# EAGLE design Amplifier Breakout (EAGLE 6.3)
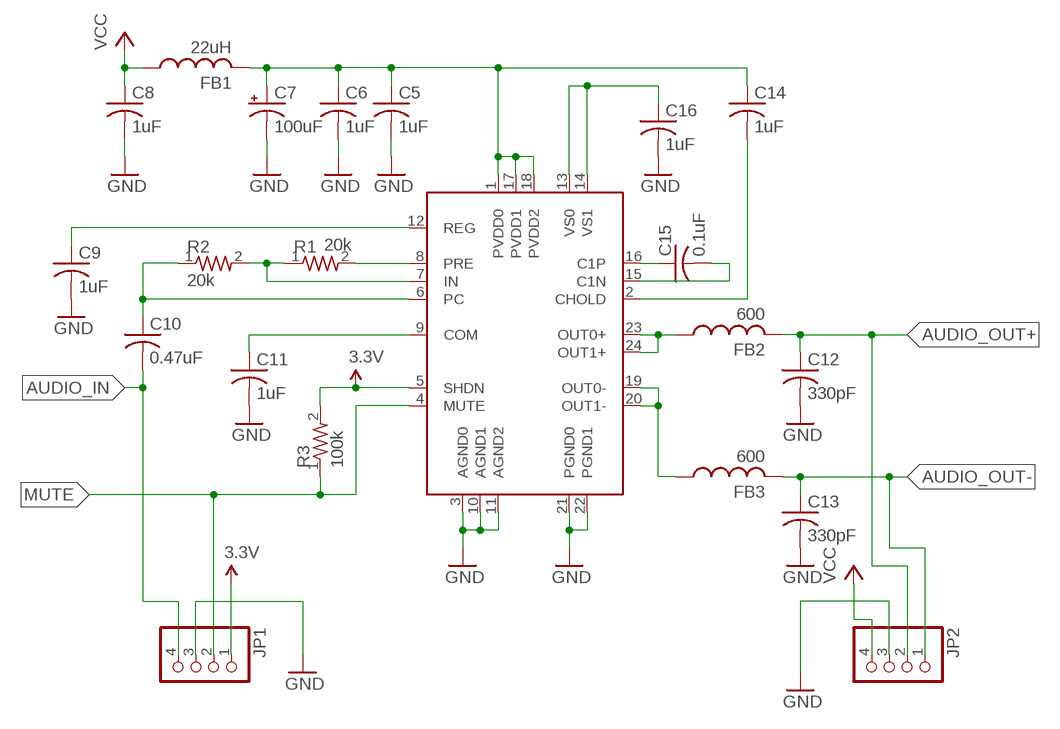
[diagram p0: schematic, sheet 1]

## Parts
C5  1uF  0805_CAP  [FB-0805]
C6  1uF  0805_CAP  [FB-0805]
C7  100uF  CAP_POL_F  [CAP_F]
C8  1uF  0805_CAP  [FB-0805]
C9  1uF  0603_CAP  [0603_RESISTOR]
C10  0.47uF  0603_CAP  [0603_RESISTOR]
C11  1uF  0603_CAP  [0603_RESISTOR]
C12  330pF  0603_CAP  [0603_RESISTOR]
C13  330pF  0603_CAP  [0603_RESISTOR]
C14  1uF  0805_CAP  [FB-0805]
C15  0.1uF  0603_CAP  [0603_RESISTOR]
C16  1uF  0603_CAP  [0603_RESISTOR]
FB1  22uH  FB  [FB-0805]
FB2  600  FB  [FB-0805]
FB3  600  FB  [FB-0805]
JP1  PINHD-1X4  [1X04]
JP2  PINHD-1X4  [1X04]
MAX1  MAX9737  [TQFN24]
R1  20k  0603_RESISTOR  [0603_RESISTOR]
R2  20k  0603_RESISTOR  [0603_RESISTOR]
R3  100k  0603_RESISTOR  [0603_RESISTOR]

## Nets
3.3V: JP1.1 MAX1.5(SHDN) R3.2
AUDIO_IN: C10.2 JP1.4
AUDIO_OUT+: C12.1 FB2.2 JP2.2
AUDIO_OUT-: C13.1 FB3.2 JP2.1
GND: C5.2 C6.2 C7.- C8.2 C9.2 C11.2 C12.2 C13.2 C16.2 JP1.3 JP2.3 MAX1.3(AGND0) MAX1.10(AGND1) MAX1.11(AGND2) MAX1.21(PGND0) MAX1.22(PGND1)
MUTE: JP1.2 MAX1.4(MUTE) R3.1
N$2: C9.1 MAX1.12(REG)
N$3: MAX1.8(PRE) R1.2
N$4: C5.1 C6.1 C7.+ C14.1 FB1.2 MAX1.1(PVDD0) MAX1.17(PVDD1) MAX1.18(PVDD2)
N$5: MAX1.7(IN) R1.1 R2.2
N$6: C10.1 MAX1.6(PC) R2.1
N$7: C11.1 MAX1.9(COM)
N$9: C14.2 MAX1.2(CHOLD)
N$10: C15.1 MAX1.16(C1P)
N$11: C15.2 MAX1.15(C1N)
N$13: C16.1 MAX1.13(VS0) MAX1.14(VS1)
N$14: FB3.1 MAX1.19(OUT0-) MAX1.20(OUT1-)
N$16: FB2.1 MAX1.23(OUT0+) MAX1.24(OUT1+)
VCC: C8.1 FB1.1 JP2.4

## Library data of the parts
C5 C6 C8 C14 = jkf-parts:0805_CAP: 0805 Capacitor
C7 = jkf-parts:CAP_POL_F: Panasonic Size F Capacitor
C9-C13 C15 C16 = jkf-parts:0603_CAP: 0603 Capacitor
FB1-FB3 = jkf-parts:FB: Ferrite Bead 0805
JP1 JP2 = pinhead:PINHD-1X4: PIN HEADER
MAX1 = jkf-parts:MAX9737: MAX9737
R1-R3 = jkf-parts:0603_RESISTOR

## Net classes
0 default: clearance 0.254 mm

## Board
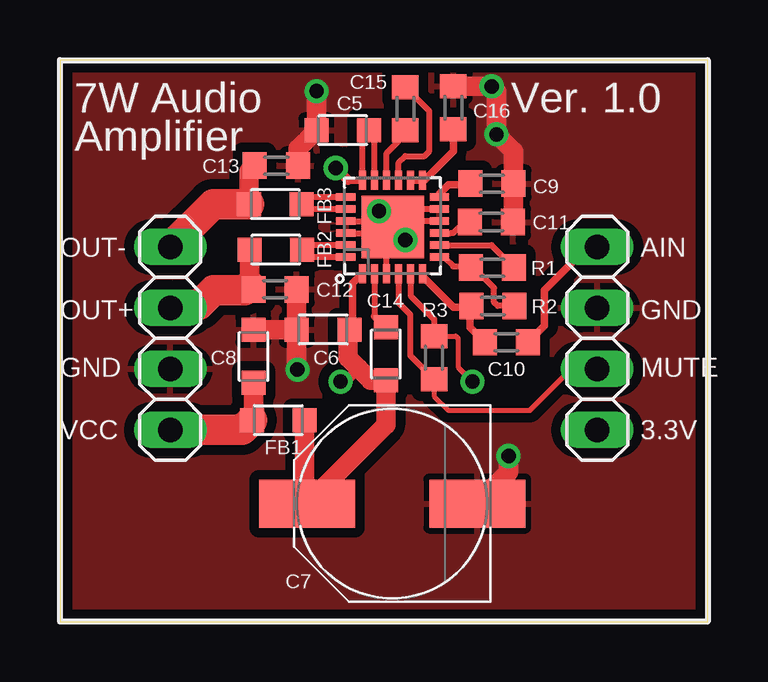
[diagram p1: board, top side]
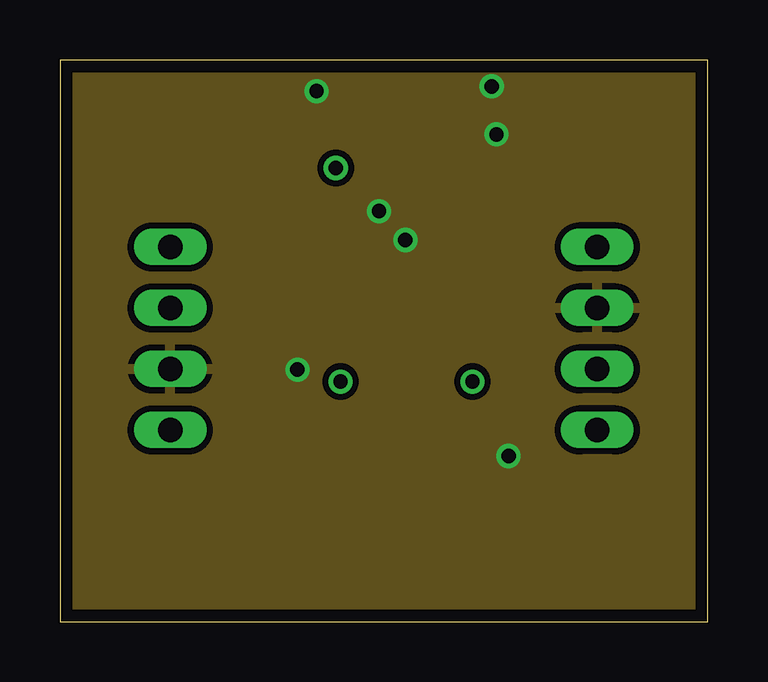
[diagram p2: board, inner layer GND]
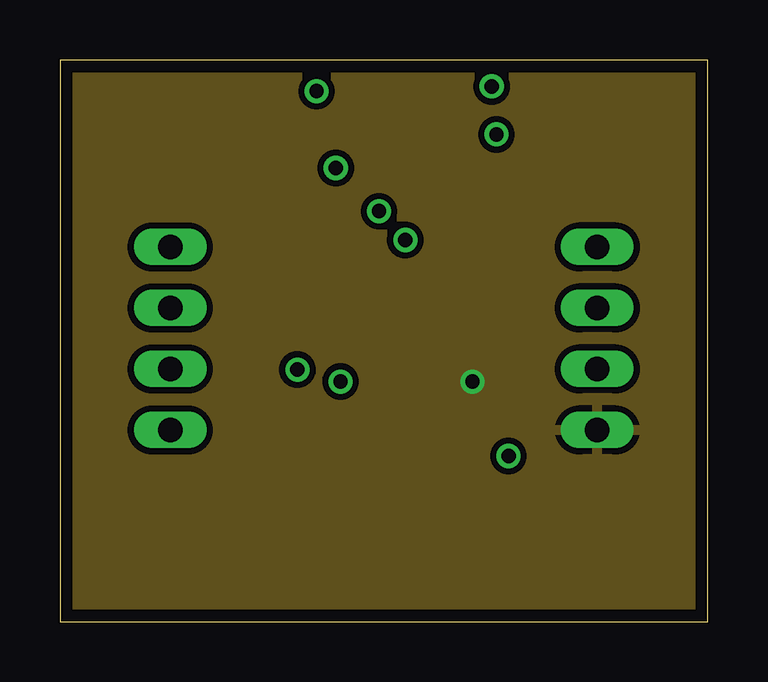
[diagram p3: board, inner layer 3.3V]
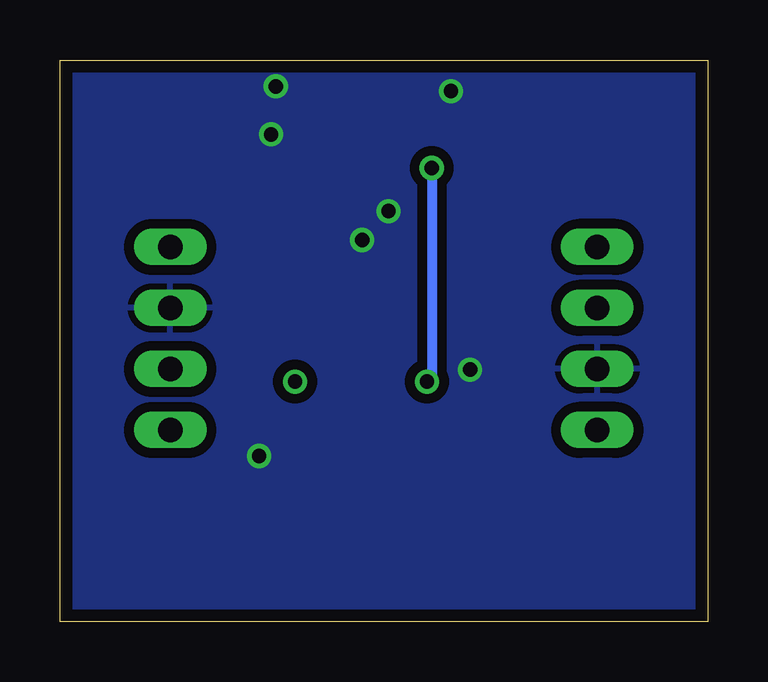
[diagram p4: board, bottom side, seen from below]

Size 27 x 23.4 mm. Coordinates in mm from the lower left corner, seen from the top.
Outline: 0,0 27,0 27,23.4 0,23.4 0,0
Copper layers (1+2*15+16): Top 0.0178mm / dielectric 12mil / GND 0.0356mm / dielectric 28mil / 3.3V 0.0356mm / dielectric 12mil / Bottom 0.0178mm
Design rules "SSC-EAGLE-4Lyr_v1.0.0.3": minimum track width 6mil, minimum drill 8mil, track to track 6mil, track to pad 6mil, pad to pad 6mil, via to via 6mil, smd to smd 6mil, copper to edge 20mil, drill to drill 16mil, minimum pad ring 8mil, minimum via ring 8mil, stop-mask expansion 3mil, vias tented up to drill 0mil, thermal gap 10mil

### Footprints (pad centres in the part's own frame; a part is rotated, then mirrored left to right if it is on the bottom)
FB-0805 = smd 1 x 1: 1 -1.1,0; 2 1.1,0
CAP_F = smd 4 x 2: + 3.55,0; - -3.55,0
0603_RESISTOR = smd 1 x 1.1: 1 -0.9,0; 2 0.9,0
1X04 = drill 1.016 long: 1 -3.81,0; 2 -1.27,0; 3 1.27,0; 4 3.81,0
TQFN24 = smd 0.8 x 0.3: 1 -2,1.25; 2 -2,0.75; 3 -2,0.25; 4 -2,-0.25; 5 -2,-0.75; 6 -2,-1.25; 13 1.9,-1.25; 14 1.9,-0.75; 15 1.9,-0.25; 16 1.9,0.25; 17 1.9,0.75; 18 1.9,1.25 | smd 0.3 x 0.8: 7 -1.3,-1.95; 8 -0.8,-1.95; 9 -0.3,-1.95; 10 0.2,-1.95; 11 0.7,-1.95; 12 1.2,-1.95; 19 1.2,1.95; 20 0.7,1.95; 21 0.2,1.95; 22 -0.3,1.95; 23 -0.8,1.95; 24 -1.3,1.95 | smd 2.6 x 2.6: EP -0.05,0

### Placement (x,y rotation side)
C5  11.79,20.47 180 top
C6  10.97,12.17 180 top
C7  13.85,4.92 180 top
C8  8.07,11.05 90 top
C9  18.01,18.25 0 top
C10  18.62,11.64 0 top
C11  17.99,16.65 0 top
C12  8.97,13.84 0 top
C13  9.02,19 0 top
C14  13.59,11.16 90 top
C15  14.4,21.37 90 top
C16  16.4,21.41 90 top
FB1  9.1,8.4 0 top
FB2  9,15.49 180 top
FB3  8.98,17.39 180 top
JP1  22.4,11.8 90 top
JP2  4.6,11.8 270 top
MAX1  13.87,16.49 90 top
R1  18.03,14.75 0 top
R2  18.05,13.15 0 top
R3  15.6,10.99 90 top

### Tracks (layer width: path | path; a pad name or v marks a point on that pad's centre or on a via)
3.3V  (via drill 0.6)
  Top 0.203: R3.2 16.51,11.89 16.6,11.8 16.6,10.6 v17.2,10
  Top 0.254: MAX1.5 14.62,13.58 15.6,12.6 R3.2
  pour 3.3V: 0,23.4 27,23.4 27,0 0,0
AUDIO_IN
  Top 0.305: C10.2 20.2,12.32 20.2,13.8 22.01,15.61 JP1.4
AUDIO_OUT+
  Top 0.813: FB2.2 7.9,14.01 C12.1
  Top 1.27: 7.9,14.01 7.69,13.8 6.4,13.8 5.8,13.2 4.73,13.2 JP2.2
AUDIO_OUT-
  Top 0.813: FB3.2 7.88,18.76 C13.1
  Top 1.27: FB3.2 6.38,17.39 JP2.1
GND  (via drill 0.6)
  Top 0.254: MAX1.3 13.62,16.78 v13.3,17.1 | MAX1.10 13.71,16.69 | MAX1.11 14,17.19 13.39,17.19 | MAX1.22 13.3,16.19 v13.3,17.1 | MAX1.21 13.3,16.69 v13.3,17.1
  Top 0.305: 13.39,17.19 v13.3,17.1 | 13.71,16.69 13.71,16.9 14,17.19
  Top 0.813: C12.2 C6.2 | C6.2 9.87,10.53 v9.9,10.5 | C16.2 v17.99,22.31 v18,22.3 18.2,22.1 v18.2,20.3 18.91,19.59 C9.2 18.91,16.67 C11.2 | C13.2 9.92,19.7 C5.2 v10.69,22.09 v10.7,22.1 | v18.7,6.9 18.7,6.22 C7.- | C8.2 9.85,12.15 C6.2
  other vias: 14.4,15.9
  pour GND: 0,23.4 27,23.4 27,0 0,0
  pour Top (isolate 0.406): 0,23.4 27,23.4 27,0 0,0
  pour Bottom (isolate 0.406): 0,23.4 27,23.4 27,0 0,0
MUTE
  Top 0.203: R3.1 15.6,9.4 16.2,8.8 19.6,8.8 21.2,10.4 22.27,10.4 JP1.2
  Top 0.254: MAX1.4 14.12,13.28 14.6,12.8 14.6,11.09 R3.1
N$2
  Top 0.305: MAX1.12 15.82,17.82 16.2,18.2 17.06,18.2 C9.1
N$3
  Top 0.254: MAX1.8 17.99,15.69 R1.2
N$4  (via drill 0.6)
  Top 0.254: MAX1.17 13.12,20.24 | MAX1.18 12.62,20.2
  Top 0.305: 13.12,20.24 C5.1 12.62,20.2 | MAX1.1 12.59,14.49 12.2,14.1 12.2,12.3 C6.1 | MAX1.18 12.01,18.39
  Top 0.406: 12.01,18.39 v11.5,18.9 | v11.7,10 11.9,10 12.45,10.55
  Top 0.813: C6.1 12,12.1 12,11 12.45,10.55 12.94,10.06 C14.1 13.59,8.21 10.69,5.31 | 10.69,5.31 C7.+ | FB1.2 10.2,5.8 10.69,5.31
  Bottom 0.305: 11.5,10.2 v11.7,10
  Bottom 0.406: v11.5,18.9 11.5,10.2
N$5
  Top 0.254: MAX1.7 16.01,15.19 16.4,14.8 17.08,14.8 R1.1 17.48,14.4 17.6,14.4 18.1,13.9 18.1,13.3 18.25,13.15 R2.2
N$6
  Top 0.305: MAX1.6 15.12,14.38 16.4,13.1 17.1,13.1 | 17.1,13.1 R2.1 | 17.1,13.1 17.1,12.26 C10.1
N$7
  Top 0.254: MAX1.9 16.29,16.19 16.3,16.2 16.4,16.2 16.6,16.4 16.84,16.4 C11.1
N$9
  Top 0.254: MAX1.2 13.12,12.73
  Top 0.305: 13.12,12.73 C14.2
N$10
  Top 0.254: MAX1.16 13.62,19.52 14.1,20 14.1,20.17 C15.1
N$11
  Top 0.254: C15.2 15.4,21.27 15.4,19.6 15.2,19.4 14.4,19.4 14.12,19.12 MAX1.15
N$13
  Top 0.305: MAX1.14 MAX1.13 15.19,18.39 16.4,19.6 C16.1
N$14
  Top 0.254: MAX1.19 10.38,17.69 | MAX1.20 10.28,17.19
  Top 0.305: 10.38,17.69 FB3.1 10.28,17.19
N$16
  Top 0.254: MAX1.23 10.3,15.69 | MAX1.24 10.4,15.19
  Top 0.305: 10.3,15.69 FB2.1 10.4,15.19
VCC
  Top 0.813: C8.1 8.07,8.47 FB1.1
  Top 1.27: JP2.4 7.59,7.99 FB1.1

### Text on the board
tSilk: 7W Audio | Ver. 1.0 | Amplifier | OUT- | AIN | OUT+ | GND | GND | MUTE | VCC | 3.3V